# Altium schematic sheet ilk_block.SchDoc
size A4
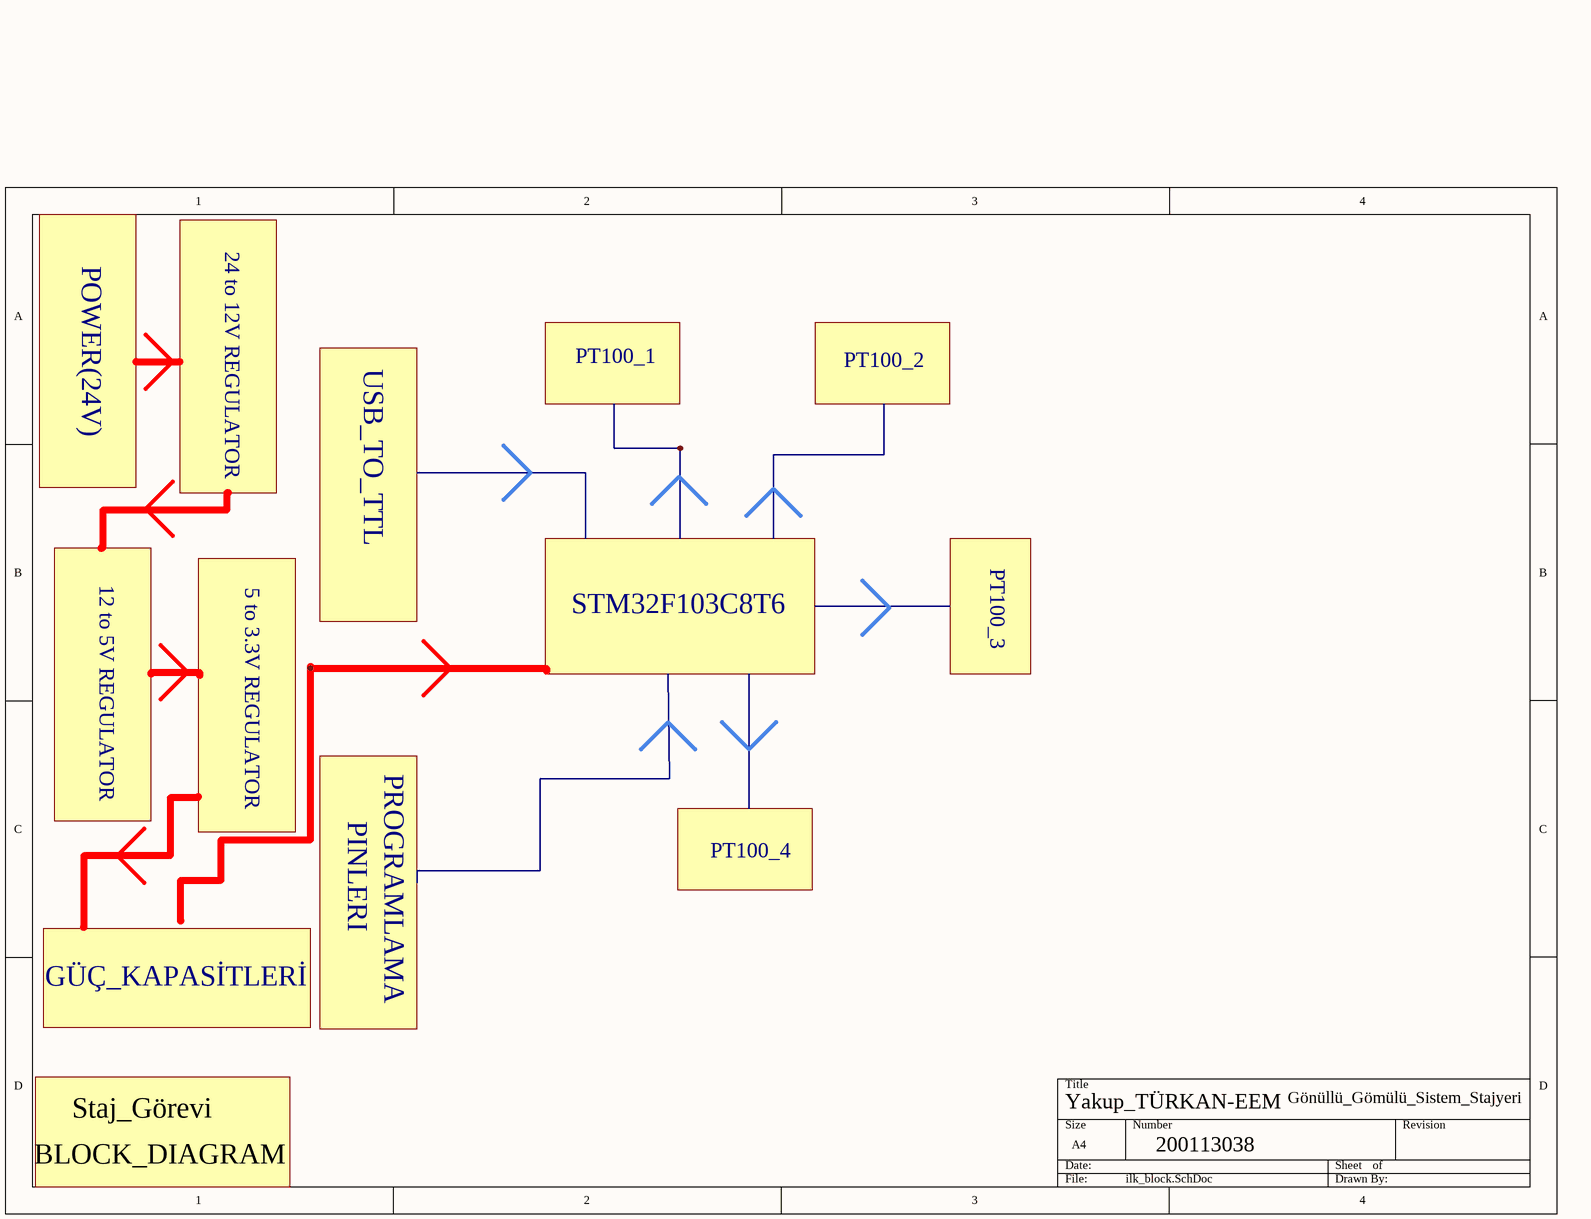
[diagram p0: ilk_block.SchDoc]

## Notes on the sheet
- POWER(24V)
- 24 to 12V REGULATOR
- USB_TO_TTL
- PT100_1
- PT100_2
- PT100_3
- 12 to 5V REGULATOR
- 5 to 3.3V REGULATOR
- STM32F103C8T6
- PROGRAMLAMA
- PINLERI
- PT100_4
- GÜÇ_KAPASİTLERİ
- Gönüllü_Gömülü_Sistem_Stajyeri
- BLOCK_DIAGRAM
- Staj_Görevi
- Yakup_TÜRKAN-EEM
- 200113038